# EAGLE design Ibrido (EAGLE 7.2.0)
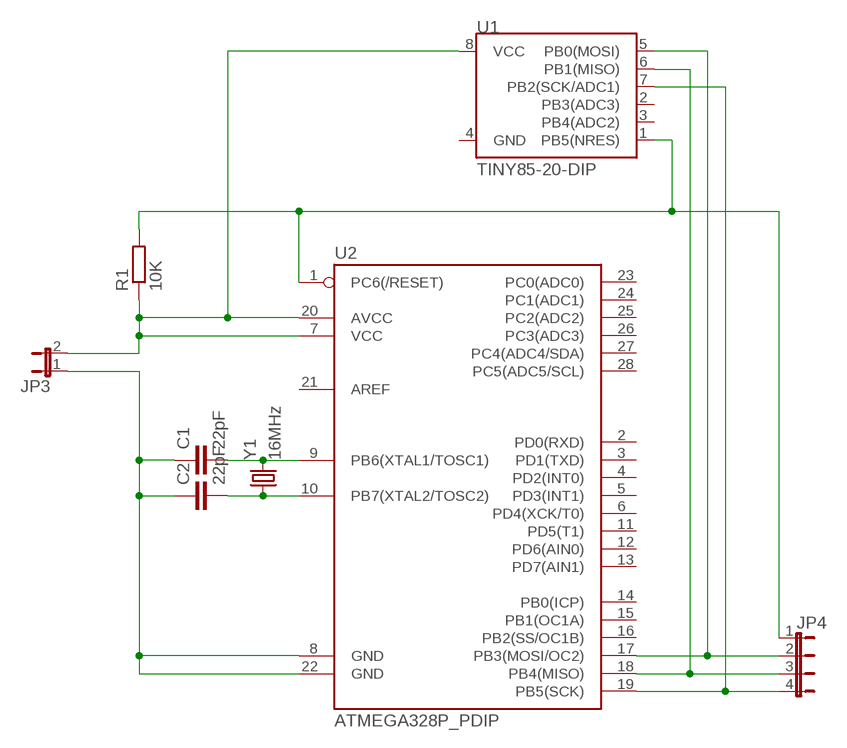
[diagram p0: schematic, sheet 1]

## Parts
C1  22pF  C-EU025-024X044  [C025-024X044]
C2  22pF  C-EU025-024X044  [C025-024X044]
JP3  JP1E  [JP1]
JP4  JP4E  [JP4]
R1  10K  R-EU_0207/15  [0207/15]
U1  TINY85-20-DIP  ATTINY45TINY85-20-DIP  [DIP08]
U2  ATMEGA328P_PDIP  [DIL28-3]
Y1  16MHz  CRYSTALHC49US  [HC49US]

## Nets
N$1: JP4.2 U1.5(PB0(MOSI)) U2.17(PB3(MOSI/OC2))
N$3: JP4.1 R1.2 U1.1(PB5(NRES)) U2.1(PC6(/RESET))
N$5: JP4.3 U1.6(PB1(MISO)) U2.18(PB4(MISO))
N$7: C1.2 U2.9(PB6(XTAL1/TOSC1)) Y1.2
N$8: C2.2 U2.10(PB7(XTAL2/TOSC2)) Y1.1
N$9: C1.1 C2.1 JP3.1 U2.8(GND) U2.22(GND)
N$10: JP3.2 R1.1 U1.8(VCC) U2.7(VCC) U2.20(AVCC)
N$14: JP4.4 U1.7(PB2(SCK/ADC1)) U2.19(PB5(SCK))
Unconnected: U1.2(PB3(ADC3)) U1.3(PB4(ADC2)) U1.4(GND) U2.2(PD0(RXD)) U2.3(PD1(TXD)) U2.4(PD2(INT0)) U2.5(PD3(INT1)) U2.6(PD4(XCK/T0)) U2.11(PD5(T1)) U2.12(PD6(AIN0)) U2.13(PD7(AIN1)) U2.14(PB0(ICP)) U2.15(PB1(OC1A)) U2.16(PB2(SS/OC1B)) U2.21(AREF) U2.23(PC0(ADC0)) U2.24(PC1(ADC1)) U2.25(PC2(ADC2)) U2.26(PC3(ADC3)) U2.27(PC4(ADC4/SDA)) U2.28(PC5(ADC5/SCL))

## Library data of the parts
C1 C2 = rcl:C-EU: CAPACITOR, European symbol
JP3 = jumper:JP1E: JUMPER
JP4 = jumper:JP4E: JUMPER
R1 = rcl:R-EU_: RESISTOR, European symbol
U1 = SparkFun-DigitalIC:ATTINY45: Atmel 8-pin 2/4/8kB flash uC; PROD_ID: IC-09445
U2 = SparkFun-DigitalIC:ATMEGA328P_PDIP: uC used in the Arduino 32kb flash, 1k EEPROM, 2k SRAM This is the through-hole version of this chip.
Y1 = SparkFun-FreqCtrl:CRYSTAL: Various standard crystals. Proven footprints.

## Board
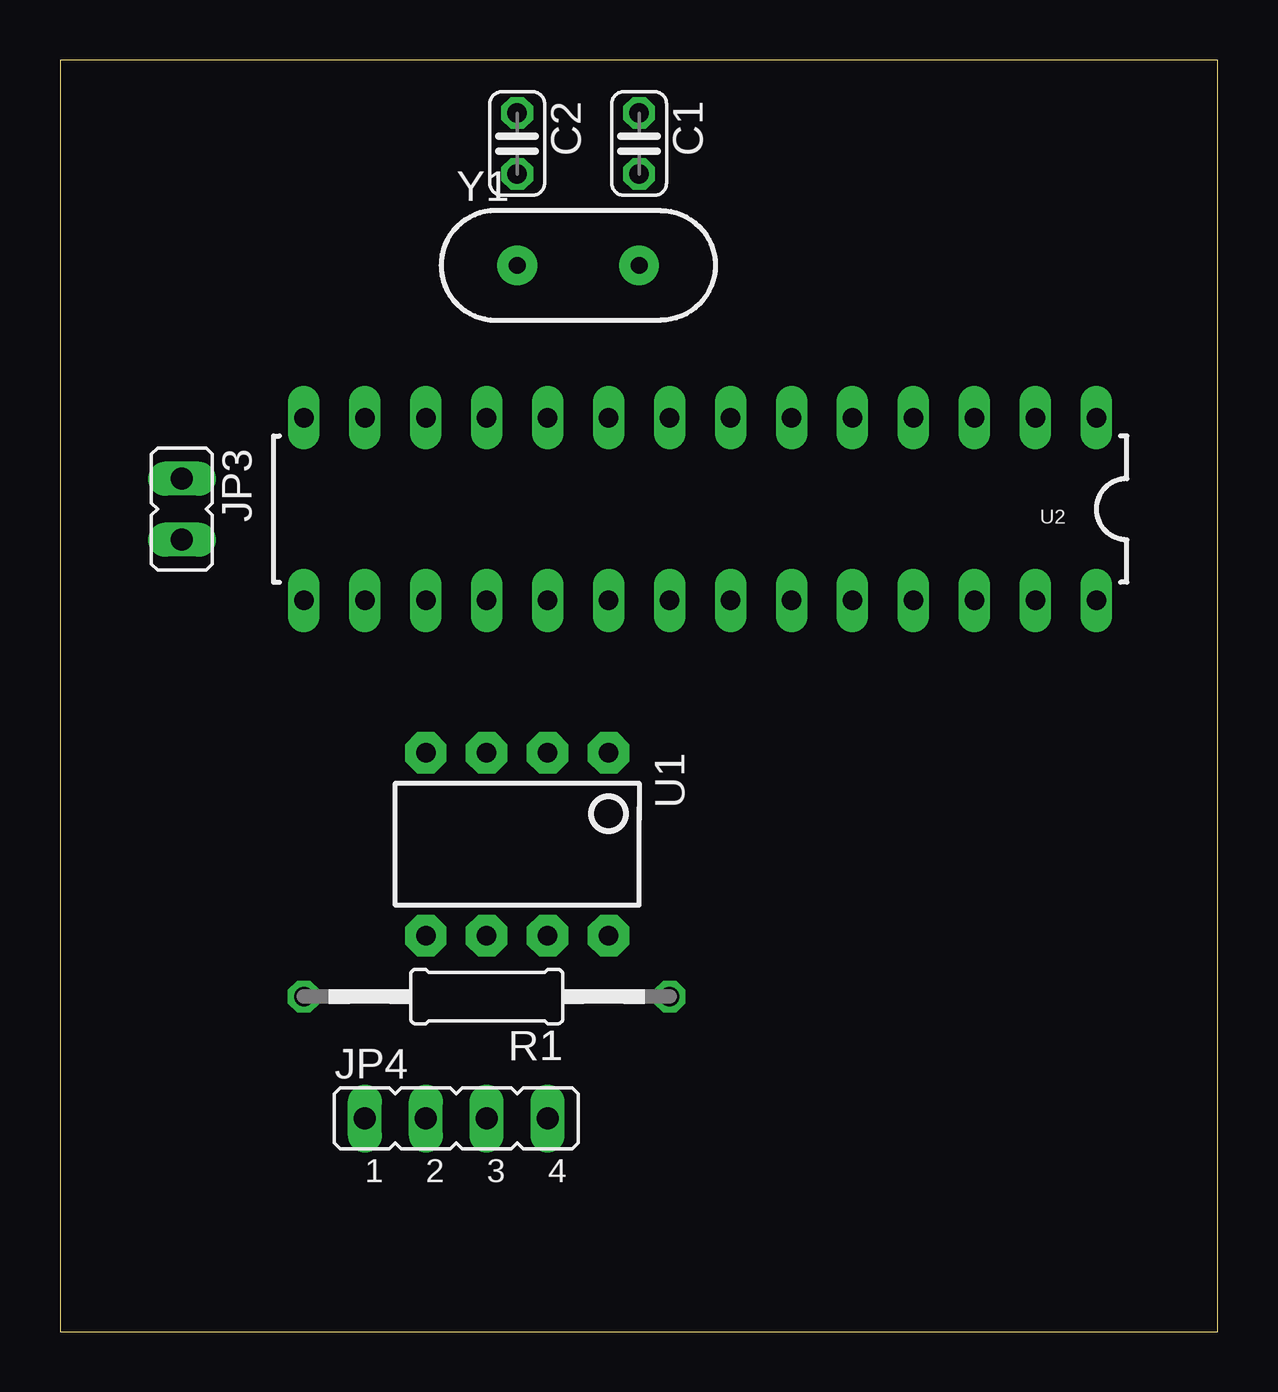
[diagram p1: board, top side]
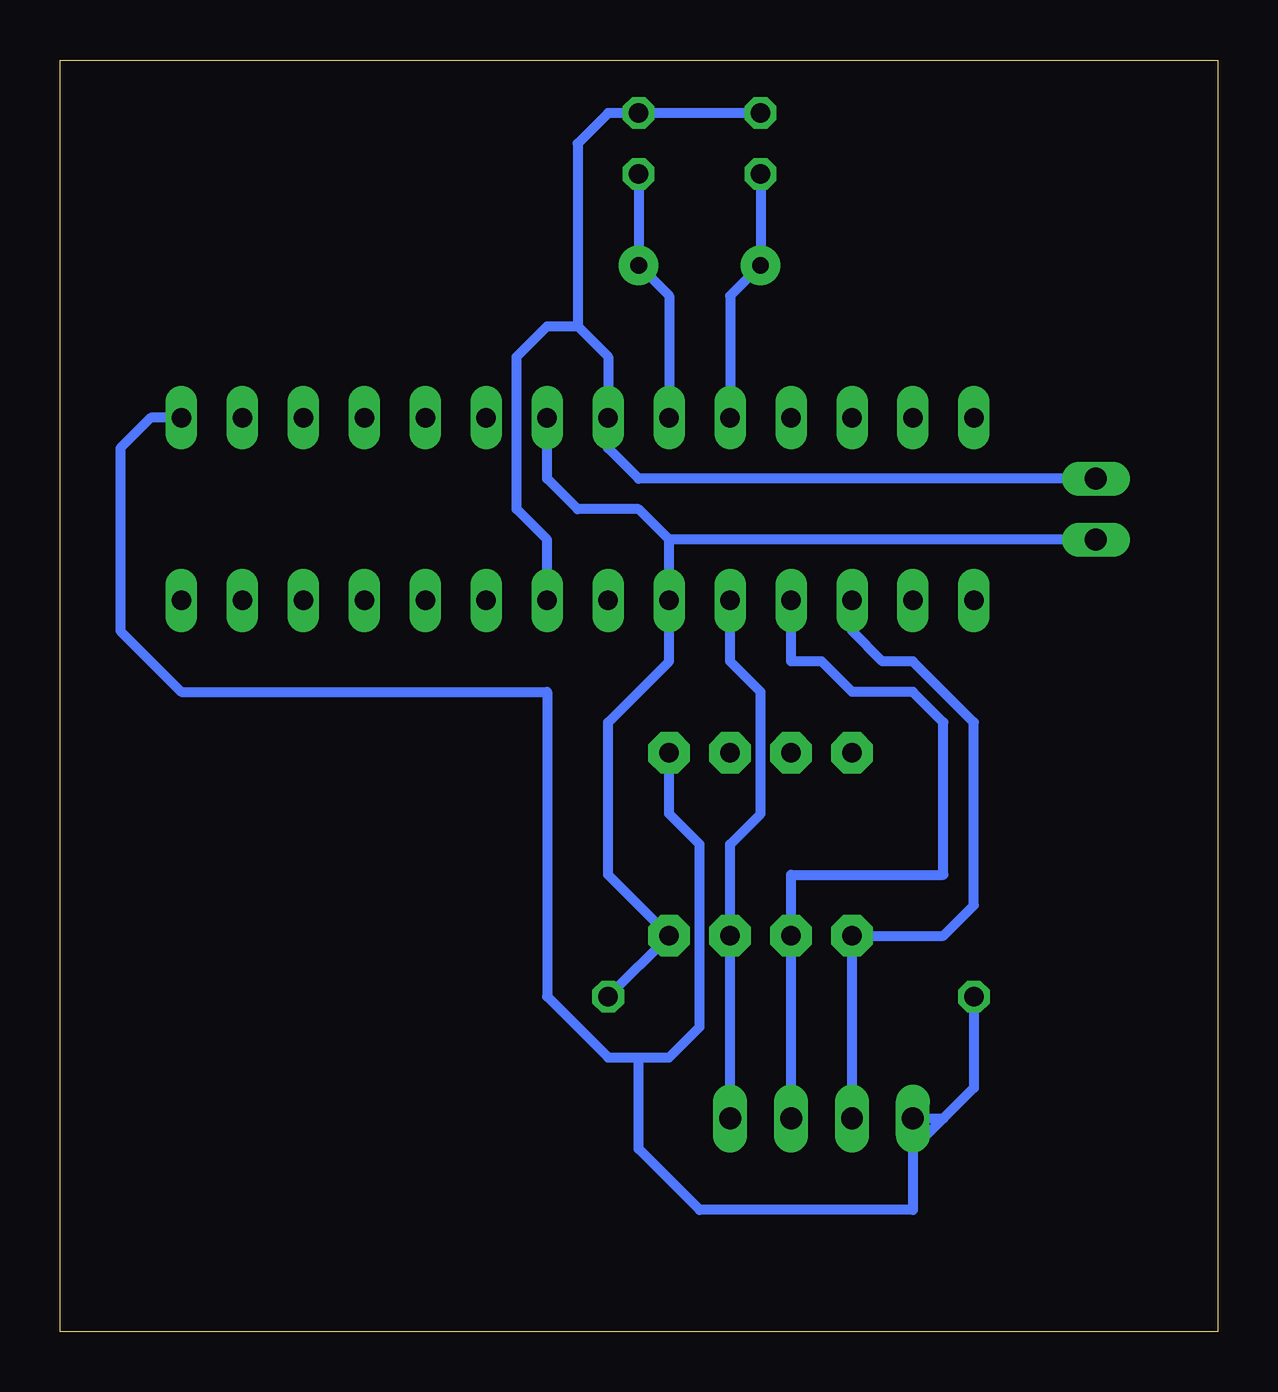
[diagram p2: board, bottom side, seen from below]

Size 48.24 x 53.01 mm. Coordinates in mm from the lower left corner, seen from the top.
Outline: 0,0 48.24,0 48.24,53.01 0,53.01 0,0
Copper layers (1*16): Top 0.035mm / dielectric 1.5mm / Bottom 0.035mm
Design rules "default": minimum track width 10mil, minimum drill 24mil, track to track 8mil, track to pad 8mil, pad to pad 8mil, via to via 8mil, smd to smd 8mil, copper to edge 40mil, drill to drill 8mil, minimum pad ring 10mil, minimum via ring 8mil, stop-mask expansion 4mil, vias tented up to drill 0mil, thermal gap 10mil

### Footprints (pad centres in the part's own frame; a part is rotated, then mirrored left to right if it is on the bottom)
C025-024X044 = drill 0.813 octagon: 1 -1.27,0; 2 1.27,0
JP1 = drill 0.914 long: 1 0,-1.27; 2 0,1.27
JP4 = drill 0.914 long: 1 -3.81,0; 2 -1.27,0; 3 1.27,0; 4 3.81,0
0207/15 = drill 0.813 octagon: 1 -7.62,0; 2 7.62,0
DIP08 = drill 0.813 pad 1.727 octagon: 1 -3.81,-3.81; 2 -1.27,-3.81; 3 1.27,-3.81; 4 3.81,-3.81; 5 3.81,3.81; 6 1.27,3.81; 7 -1.27,3.81; 8 -3.81,3.81
DIL28-3 = drill 0.813 long: 1 -16.51,-3.81; 2 -13.97,-3.81; 3 -11.43,-3.81; 4 -8.89,-3.81; 5 -6.35,-3.81; 6 -3.81,-3.81; 7 -1.27,-3.81; 8 1.27,-3.81; 9 3.81,-3.81; 10 6.35,-3.81; 11 8.89,-3.81; 12 11.43,-3.81; 13 13.97,-3.81; 14 16.51,-3.81; 15 16.51,3.81; 16 13.97,3.81; 17 11.43,3.81; 18 8.89,3.81; 19 6.35,3.81; 20 3.81,3.81; 21 1.27,3.81; 22 -1.27,3.81; 23 -3.81,3.81; 24 -6.35,3.81; 25 -8.89,3.81; 26 -11.43,3.81; 27 -13.97,3.81; 28 -16.51,3.81
HC49US = drill 0.7 pad 1.651: 1 -2.54,0; 2 2.54,0

### Placement (x,y rotation side)
C1  24.13,49.53 270 top
C2  19.05,49.53 270 top
JP3  5.08,34.29 180 top
JP4  16.51,8.89 0 top
R1  17.78,13.97 180 top
U1  19.05,20.32 180 top
U2  26.67,34.29 180 top
Y1  21.59,44.45 0 top

### Tracks (layer width: path | path; a pad name or v marks a point on that pad's centre or on a via)
N$1
  Bottom 0.406: JP4.2 U1.5 11.43,16.51 10.16,17.78 10.16,25.4 12.7,27.94 13.97,27.94 15.24,29.21 U2.17
N$3
  Bottom 0.406: JP4.1 11.43,8.89 | U2.1 44.45,38.1 45.72,36.83 45.72,29.21 43.18,26.67 27.94,26.67 27.94,13.97 25.4,11.43 24.13,11.43 | 24.13,11.43 22.86,11.43 21.59,12.7 21.59,20.32 22.86,21.59 U1.1 | R1.2 10.16,10.16 11.43,8.89 | 11.43,8.89 12.7,7.62 12.7,5.08 21.59,5.08 24.13,7.62 24.13,11.43
N$5
  Bottom 0.406: JP4.3 U1.6 17.78,19.05 11.43,19.05 11.43,25.4 12.7,26.67 15.24,26.67 16.51,27.94 17.78,27.94 U2.18
N$7
  Bottom 0.406: C1.2 Y1.2 22.86,43.18 U2.9
N$8
  Bottom 0.406: C2.2 Y1.1 20.32,43.18 U2.10
N$9
  Bottom 0.406: JP3.1 24.13,35.56 25.4,36.83 U2.8 25.4,40.64 26.67,41.91 | C2.1 C1.1 25.4,50.8 26.67,49.53 26.67,41.91 | U2.22 27.94,33.02 29.21,34.29 29.21,40.64 27.94,41.91 26.67,41.91
N$10
  Bottom 0.406: R1.1 U1.8 25.4,19.05 25.4,25.4 22.86,27.94 U2.20 22.86,33.02 | 22.86,33.02 24.13,34.29 26.67,34.29 27.94,35.56 U2.7 | JP3.2 22.86,33.02
N$14
  Bottom 0.406: JP4.4 U1.7 20.32,20.32 19.05,21.59 19.05,26.67 20.32,27.94 U2.19